# Altium schematic sheet 11_Zynq MIO.SchDoc
size A3; SheetNumber: 11; SheetTotal: 14
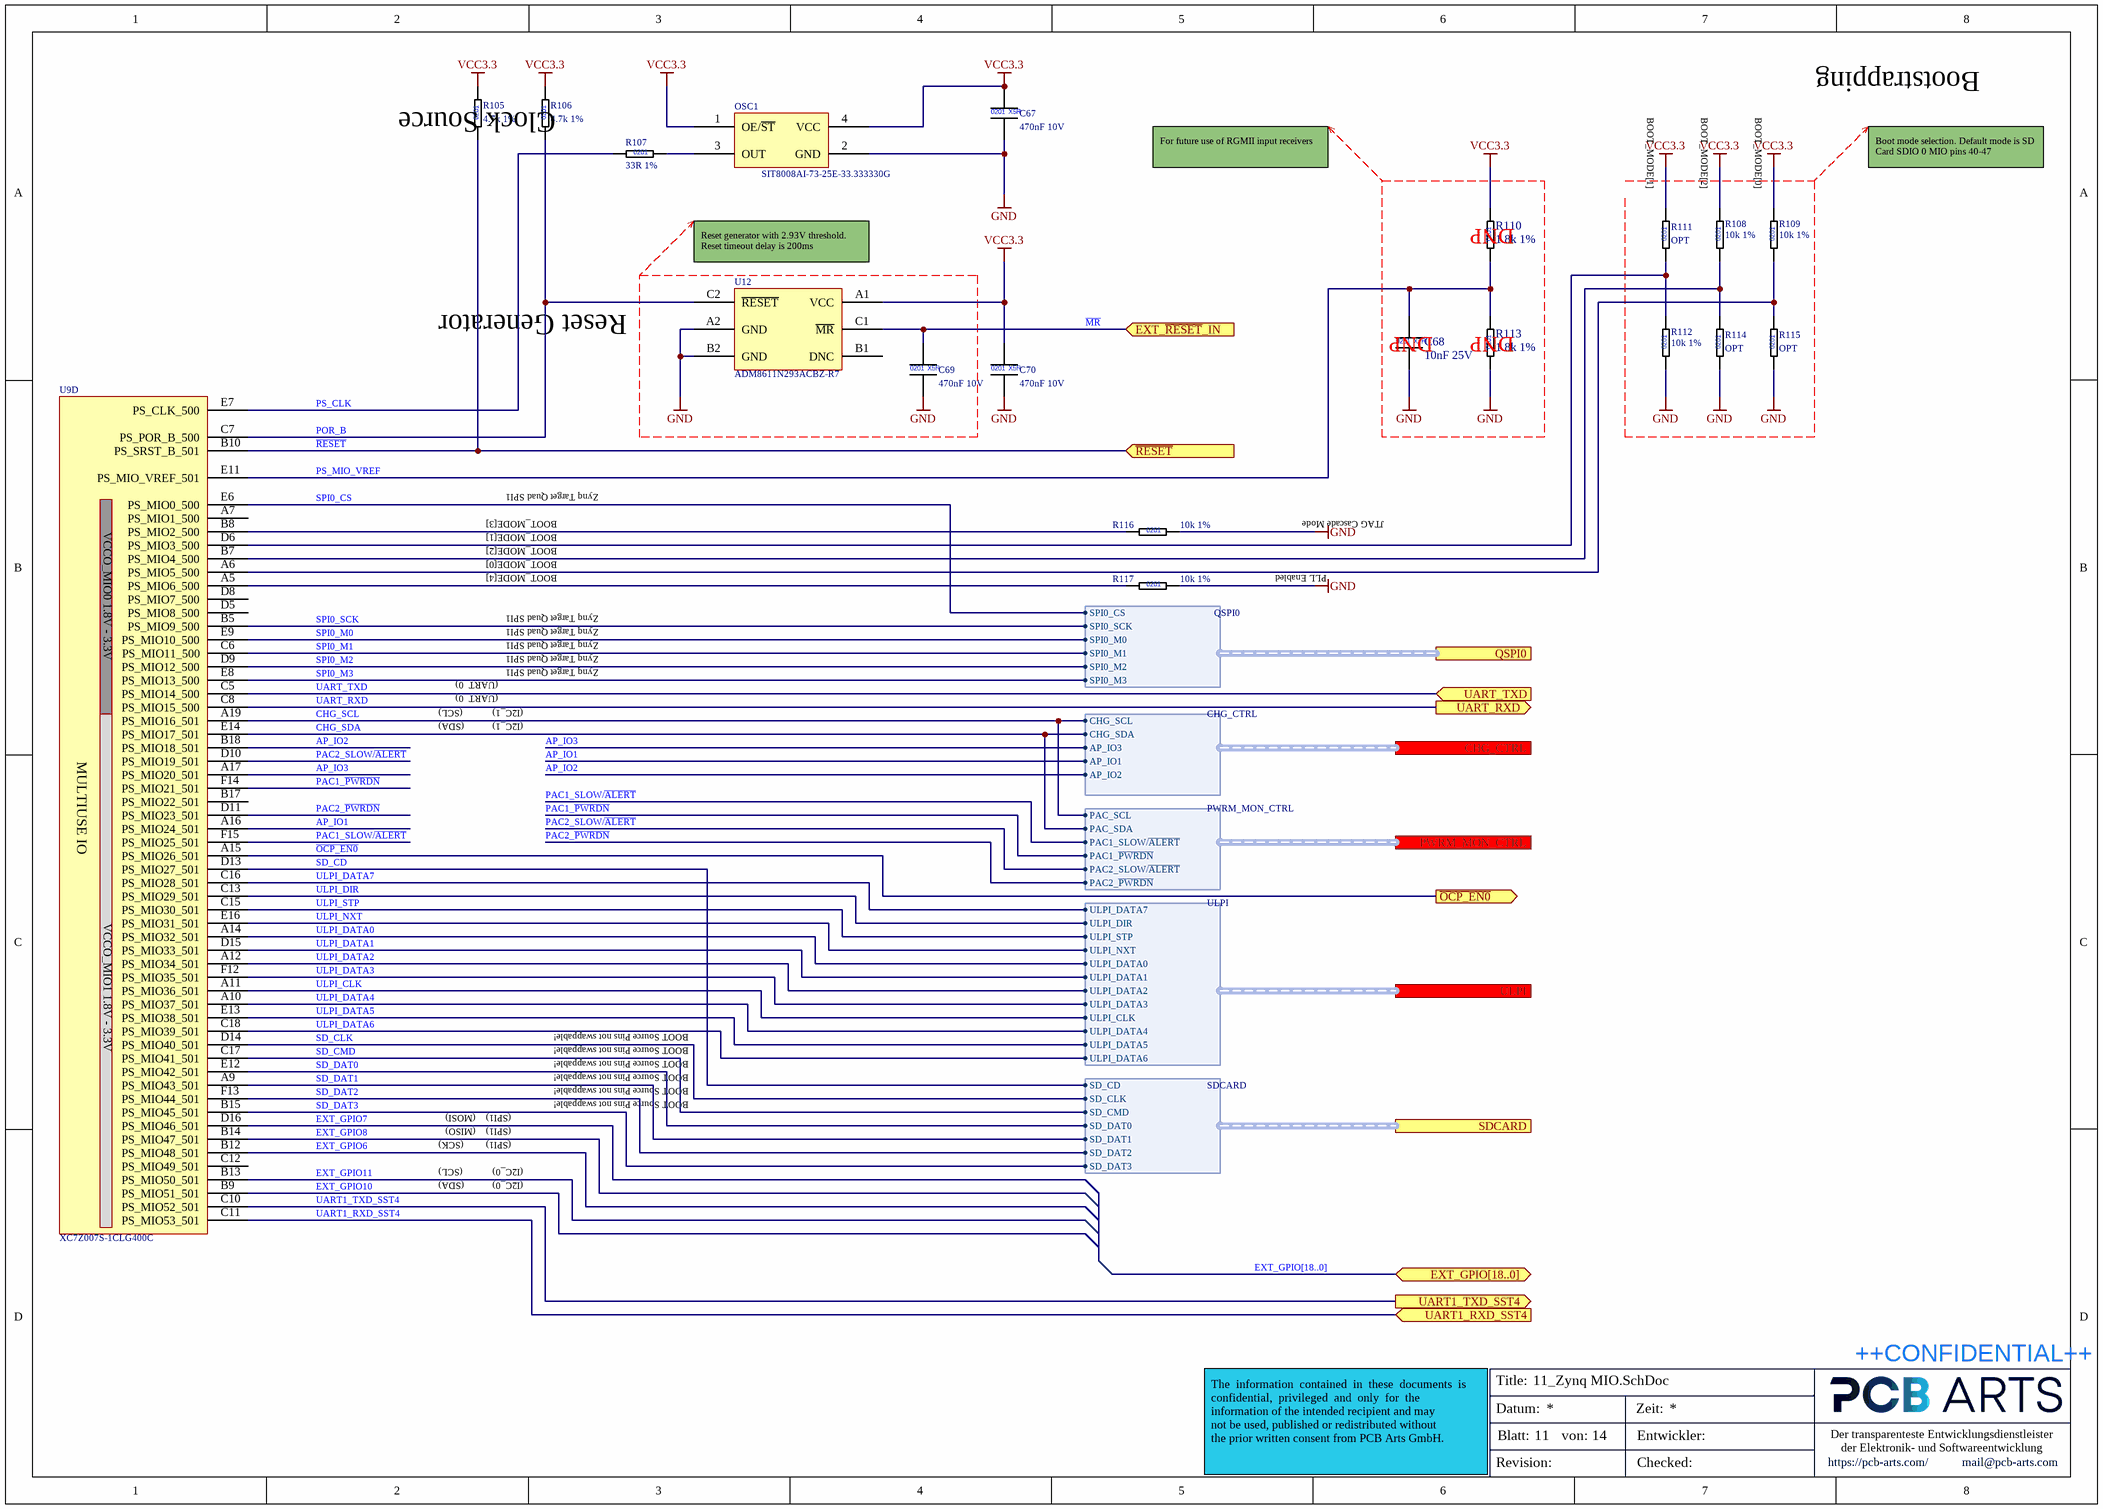
[diagram p0: 11_Zynq MIO.SchDoc]

## Parts
C67  470nF 10V  [CAPC0603X03L]
C68  10nF 25V  [CAPC0603X03L]
C69  470nF 10V  [CAPC0603X03L]
C70  470nF 10V  [CAPC0603X03L]
OSC1  SIT8008AI-73-25E-33.333330G  [SiT8008]
R105  4.7k 1%  [RESC0603X03L]
R106  4.7k 1%  [RESC0603X03L]
R107  33R 1%  [RESC0603X03L]
R108  10k 1%  [RESC0603X03L]
R109  10k 1%  [RESC0603X03L]
R110  1.8k 1%  [RESC0603X03L]
R111  OPT  [RESC0603X03L]  (no BOM)
R112  10k 1%  [RESC0603X03L]
R113  1.8k 1%  [RESC0603X03L]
R114  OPT  [RESC0603X03L]  (no BOM)
R115  OPT  [RESC0603X03L]  (no BOM)
R116  10k 1%  [RESC0603X03L]
R117  10k 1%  [RESC0603X03L]
U9  XC7Z007S-1CLG400C  [BGA400C80P20X20_1700X1700X160]  (part D of 8)
U12  ADM8611N293ACBZ-R7  [BGA6C50P2X3_96X146X66]

## Ports
CHG_CTRL (harness CHG_CTRL), EXT_GPIO[18..0] (bidir), EXT_~{RESET}_IN (in), PWRM_MON_CTRL (harness PWRM_MON_CTRL), QSPI0 (harness QSPI0), SDCARD (harness SDCARD), UART1_RXD_SST4 (in), UART1_TXD_SST4 (out), UART_RXD (out), UART_TXD (in), ULPI (harness ULPI), ~{OCP_EN0} (out), ~{RESET} (in)

## Harnesses
CHG_CTRL: CHG_SDA, CHG_SCL, AP_IO1, AP_IO2, AP_IO3
PWRM_MON_CTRL: PAC1_SLOW/~{ALERT}, PAC_SCL, PAC1_~{PWRDN}, PAC_SDA, PAC2_SLOW/~{ALERT}, PAC2_~{PWRDN}
QSPI0: SPI0_SCK, SPI0_CS, SPI0_M0, SPI0_M1, SPI0_M2, SPI0_M3
SDCARD: SD_DAT3, SD_CMD, SD_CLK, SD_DAT0, SD_DAT1, SD_DAT2, SD_CD
ULPI: ULPI_DATA7, ULPI_DIR, ULPI_STP, ULPI_NXT, ULPI_DATA0, ULPI_DATA1, ULPI_DATA2, ULPI_DATA3, ULPI_CLK, ULPI_DATA4, ULPI_DATA5, ULPI_DATA6

## Nets
GND: C67.2 C68.2 C69.2 C70.2 OSC1.2(GND) R112.1 R113.1 R114.1 R115.1 R116.2 R117.2 U12.A2(GND) U12.B2(GND)
VCC3.3: C67.1 C70.1 OSC1.1(OE/~{ST}) OSC1.4(VCC) R105.2 R106.2 R108.2 R109.2 R110.2 R111.2 U12.A1(VCC)
AP_IO1: U9.A16(PS_MIO24_501) ; port CHG_CTRL.AP_IO1
AP_IO2: U9.B18(PS_MIO18_501) ; port CHG_CTRL.AP_IO2
AP_IO3: U9.A17(PS_MIO20_501) ; port CHG_CTRL.AP_IO3
CHG_SCL: U9.A19(PS_MIO16_501) ; port CHG_CTRL.CHG_SCL, port PWRM_MON_CTRL.PAC_SCL
CHG_SDA: U9.E14(PS_MIO17_501) ; port CHG_CTRL.CHG_SDA, port PWRM_MON_CTRL.PAC_SDA
EXT_GPIO6: U9.B12(PS_MIO48_501)
EXT_GPIO7: U9.D16(PS_MIO46_501)
EXT_GPIO8: U9.B14(PS_MIO47_501)
EXT_GPIO10: U9.B9(PS_MIO51_501)
EXT_GPIO11: U9.B13(PS_MIO50_501)
~{MR}: C69.1 U12.C1(~{MR}) ; port EXT_~{RESET}_IN
~{OCP_EN0}: U9.A15(PS_MIO26_501) ; port ~{OCP_EN0}
PAC1_~{PWRDN}: U9.F14(PS_MIO21_501) ; port PWRM_MON_CTRL.PAC1_~{PWRDN}
PAC1_SLOW/~{ALERT}: U9.F15(PS_MIO25_501) ; port PWRM_MON_CTRL.PAC1_SLOW/~{ALERT}
PAC2_~{PWRDN}: U9.D11(PS_MIO23_501) ; port PWRM_MON_CTRL.PAC2_~{PWRDN}
PAC2_SLOW/~{ALERT}: U9.D10(PS_MIO19_501) ; port PWRM_MON_CTRL.PAC2_SLOW/~{ALERT}
POR_B: R106.1 U9.C7(PS_POR_B_500) U12.C2(~{RESET})
PS_CLK: R107.1 U9.E7(PS_CLK_500)
PS_MIO_VREF: C68.1 R110.1 R113.2 U9.E11(PS_MIO_VREF_501)
~{RESET}: R105.1 U9.B10(PS_SRST_B_501) ; port ~{RESET}
SD_CD: U9.D13(PS_MIO27_501) ; port SDCARD.SD_CD
SD_CLK: U9.D14(PS_MIO40_501) ; port SDCARD.SD_CLK
SD_CMD: U9.C17(PS_MIO41_501) ; port SDCARD.SD_CMD
SD_DAT0: U9.E12(PS_MIO42_501) ; port SDCARD.SD_DAT0
SD_DAT1: U9.A9(PS_MIO43_501) ; port SDCARD.SD_DAT1
SD_DAT2: U9.F13(PS_MIO44_501) ; port SDCARD.SD_DAT2
SD_DAT3: U9.B15(PS_MIO45_501) ; port SDCARD.SD_DAT3
SPI0_CS: U9.E6(PS_MIO0_500) ; port QSPI0.SPI0_CS
SPI0_M0: U9.E9(PS_MIO10_500) ; port QSPI0.SPI0_M0
SPI0_M1: U9.C6(PS_MIO11_500) ; port QSPI0.SPI0_M1
SPI0_M2: U9.D9(PS_MIO12_500) ; port QSPI0.SPI0_M2
SPI0_M3: U9.E8(PS_MIO13_500) ; port QSPI0.SPI0_M3
SPI0_SCK: U9.B5(PS_MIO9_500) ; port QSPI0.SPI0_SCK
UART1_RXD_SST4: U9.C11(PS_MIO53_501) ; port UART1_RXD_SST4
UART1_TXD_SST4: U9.C10(PS_MIO52_501) ; port UART1_TXD_SST4
UART_RXD: U9.C8(PS_MIO15_500) ; port UART_RXD
UART_TXD: U9.C5(PS_MIO14_500) ; port UART_TXD
ULPI_CLK: U9.A11(PS_MIO36_501) ; port ULPI.ULPI_CLK
ULPI_DATA0: U9.A14(PS_MIO32_501) ; port ULPI.ULPI_DATA0
ULPI_DATA1: U9.D15(PS_MIO33_501) ; port ULPI.ULPI_DATA1
ULPI_DATA2: U9.A12(PS_MIO34_501) ; port ULPI.ULPI_DATA2
ULPI_DATA3: U9.F12(PS_MIO35_501) ; port ULPI.ULPI_DATA3
ULPI_DATA4: U9.A10(PS_MIO37_501) ; port ULPI.ULPI_DATA4
ULPI_DATA5: U9.E13(PS_MIO38_501) ; port ULPI.ULPI_DATA5
ULPI_DATA6: U9.C18(PS_MIO39_501) ; port ULPI.ULPI_DATA6
ULPI_DATA7: U9.C16(PS_MIO28_501) ; port ULPI.ULPI_DATA7
ULPI_DIR: U9.C13(PS_MIO29_501) ; port ULPI.ULPI_DIR
ULPI_NXT: U9.E16(PS_MIO31_501) ; port ULPI.ULPI_NXT
ULPI_STP: U9.C15(PS_MIO30_501) ; port ULPI.ULPI_STP
NetOSC1_3: OSC1.3(OUT) R107.2
NetR108_1: R108.1 R114.2 U9.B7(PS_MIO4_500)
NetR109_1: R109.1 R115.2 U9.A6(PS_MIO5_500)
NetR111_1: R111.1 R112.2 U9.D6(PS_MIO3_500)
NetR116_1: R116.1 U9.B8(PS_MIO2_500)
NetR117_1: R117.1 U9.A5(PS_MIO6_500)

Not connected (* = marked no-connect by the designer): U9 A7(PS_MIO1_500) B17(PS_MIO22_501) C12(PS_MIO49_501) D5(PS_MIO8_500) D8(PS_MIO7_500); U12 B1(DNC)

## Buses and harness runs
bus EXT_GPIO[18..0] = port EXT_GPIO[18..0]

## Notes on the sheet
- Bootstrapping
- Clock Source
- For future use of RGMII input receivers
- Boot mode selection. Default mode is SD Card SDIO 0 MIO pins 40-47
- (near R110) DNP
- (near R111) BOOT_MODE[1]
- (near R108) BOOT_MODE[2]
- (near R109) BOOT_MODE[0]
- (near U12) Reset generator with 2.93V threshold. Reset timeout delay is 200ms
- Reset Generator
- (near C68) DNP
- (near R113) DNP
- Zynq Target Quad SPI1
- BOOT_MODE[0]
- BOOT_MODE[1]
- BOOT_MODE[2]
- BOOT_MODE[3]
- BOOT_MODE[4]
- PLL Enabled
- JTAG Cascade Mode
- (SCL)
- (UART_0)
- (I2C_1)
- (SDA)
- BOOT Source Pins not swappable!
- (MOSI)
- (SPI1)
- (SCK)
- (MISO)
- (I2C_0)
- Title:
- ++CONFIDENTIAL++
- Datum:
- Blatt:
- von:
- Zeit:
- Entwickler:
- Der transparenteste Entwicklungsdienstleister
  der Elektronik- und Softwareentwicklung
- The  information  contained  in  these  documents  is  confidential,  privileged  and  only  for  the
  information of the intended recipient and may
  not be used, published or redistributed without
  the prior written consent from PCB Arts GmbH.
- Revision:
- Checked:
- https://pcb-arts.com/
- mail@pcb-arts.com
- (in symbol CAP_0201_10nF_25V) 0201; X7R
- (in symbol CAP_0201_470nF_10V) 0201; X5R
- (in symbol RES_0201_1.8k_1%) 0201
- (in symbol RES_0201_4.7k_1%) 0201
- (in symbol RES_0201_10k_1%) 0201
- (in symbol RES_0201_33R_1%) 0201
- (in symbol RES_0201_OPT) 0201
- (in symbol XC7Z007S-1CLG400C_Processors - Application Specialised, part D) VCCO_MIO0 1.8V - 3.3V; MULTIUSE IO; VCCO_MIO1 1.8V - 3.3V

## Library data of the parts
C67 C69 C70 = CAP_0201_470nF_10V: Multilayer Ceramic Capacitors MLCC - SMD/SMT 0201 10VDC; Manufacturer 1: Taiyo Yuden; Manufacturer 1 Prt. Nr.: LMK063BBJ474KPLF; Manufacturer 2 Prt. Nr.: C0603X5R1A474M030BC; Manufacturer 2: TDK
C68 = CAP_0201_10nF_25V: Multilayer Ceramic Capacitors MLCC - SMD/SMT 0201 25VDC; Manufacturer 1: Murata Electronics; Manufacturer 1 Prt. Nr.: GRM033C81E103KE14D; Manufacturer 2 Prt. Nr.: 02013C103KAT2A; Manufacturer 2: AVX
OSC1 = SIT8008AI_Clock Oscillators 33.33333MHz: Standard Clock Oscillators 33.33333MHz 2.5V 50ppm -40C +85C; Manufacturer 1: SiTime; Manufacturer 1 Prt. Nr.: SIT8008AI-73-25E-33.333330G
R105 R106 = RES_0201_4.7k_1%: Thick Film Resistors - SMD 4.7K OHM 1%; Manufacturer 1: Yageo; Manufacturer 1 Prt. Nr.: RC0201JR-074K7P; Manufacturer 2 Prt. Nr.: CRCW02014K70FNED; Manufacturer 2: Vishay / Dale
R107 = RES_0201_33R_1%: Thick Film Resistors - SMD 33R OHM 1%; Manufacturer 1: Yageo; Manufacturer 1 Prt. Nr.: RC0201FR-0733RL; Manufacturer 2 Prt. Nr.: CRCW020133R0FNED; Manufacturer 2: Vishay / Dale
R108 R109 R112 R116 R117 = RES_0201_10k_1%: Thick Film Resistors - SMD 10K OHM 1%; Manufacturer 1: Yageo; Manufacturer 1 Prt. Nr.: RC0201FR-0710KL; Manufacturer 2 Prt. Nr.: CRCW020110K0FNED; Manufacturer 2: Vishay / Dale
R110 R113 = RES_0201_1.8k_1%: Thick Film Resistors - SMD 1.8K OHM 1%; Manufacturer 1: Panasonic; Manufacturer 1 Prt. Nr.: ERJ-1GNF1801C; Manufacturer 2 Prt. Nr.: CRCW02011K80FKED; Manufacturer 2: Vishay / Dale
R111 R114 R115 = RES_0201_OPT: Thick Film Resistors - SMD Optinal
U9 = XC7Z007S-1CLG400C_Processors - Application Specialised: Manufacturer 1: Xilinx; Manufacturer 1 Prt. Nr.: XC7Z007S-1CLG400C
U12 = ADM8611N293ACBZ-R7_Supervisory Circuits IC: Supervisory Circuits IC, Reset Only ULP Supervisory Circuit; Manufacturer 1: Analog Devices; Manufacturer 1 Prt. Nr.: ADM8611N293ACBZ-R7